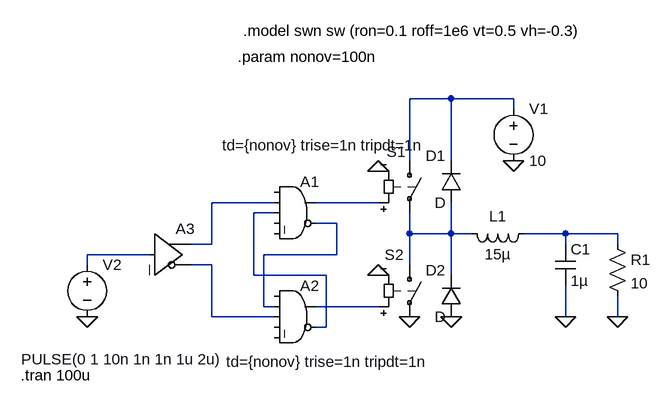
[diagram p0: schematic nonov.asc]
nonov.asc, the LTspice schematic file:
Version 4
SHEET 1 880 680
WIRE 352 16 288 16
WIRE 448 16 352 16
WIRE 448 32 448 16
WIRE 288 112 288 16
WIRE 352 112 352 16
WIRE 80 176 -16 176
WIRE 240 176 144 176
WIRE 80 192 48 192
WIRE 176 208 144 208
WIRE 288 224 288 192
WIRE 352 224 352 176
WIRE 352 224 288 224
WIRE 384 224 352 224
WIRE 528 224 464 224
WIRE 608 224 528 224
WIRE -16 240 -16 176
WIRE -16 240 -48 240
WIRE 528 240 528 224
WIRE 608 240 608 224
WIRE -112 256 -208 256
WIRE 176 256 176 208
WIRE 176 256 64 256
WIRE -208 272 -208 256
WIRE -16 272 -48 272
WIRE 288 272 288 224
WIRE 48 288 48 192
WIRE 160 288 48 288
WIRE 352 288 352 224
WIRE 64 336 64 256
WIRE 80 336 64 336
WIRE 240 336 144 336
WIRE -16 352 -16 272
WIRE 80 352 -16 352
WIRE 528 352 528 304
WIRE 608 352 608 320
WIRE 160 368 160 288
WIRE 160 368 144 368
FLAG 240 128 0
FLAG 240 288 0
FLAG 528 352 0
FLAG 608 352 0
FLAG 288 352 0
FLAG 448 112 0
FLAG -208 352 0
FLAG 352 352 0
SYMBOL sw 288 96 R0
WINDOW 0 -35 2 Left 0
SYMATTR InstName S1
SYMATTR Value ""
SYMATTR SpiceModel swn
SYMBOL sw 288 256 R0
WINDOW 0 -38 0 Left 0
SYMATTR InstName S2
SYMATTR Value ""
SYMATTR SpiceModel swn
SYMBOL ind 480 208 R90
WINDOW 0 5 56 VBottom 0
WINDOW 3 32 56 VTop 0
SYMATTR InstName L1
SYMATTR Value 15µ
SYMBOL cap 512 240 R0
SYMATTR InstName C1
SYMATTR Value 1µ
SYMBOL res 592 224 R0
SYMATTR InstName R1
SYMATTR Value 10
SYMBOL voltage 448 16 R0
WINDOW 123 0 0 Left 0
WINDOW 39 0 0 Left 0
SYMATTR InstName V1
SYMATTR Value 10
SYMBOL Digital\\and 112 128 R0
WINDOW 3 -112 -40 Left 0
SYMATTR InstName A1
SYMATTR Value td={nonov} trise=1n tripdt=1n
SYMBOL Digital\\buf -112 192 R0
SYMATTR InstName A3
SYMBOL voltage -208 256 R0
WINDOW 3 -101 161 Left 0
WINDOW 123 0 0 Left 0
WINDOW 39 0 0 Left 0
SYMATTR InstName V2
SYMATTR Value PULSE(0 1 10n 1n 1n 1u 2u)
SYMBOL Digital\\and 112 288 R0
WINDOW 3 -106 133 Left 0
SYMATTR InstName A2
SYMATTR Value td={nonov} trise=1n tripdt=1n
SYMBOL diode 368 176 R180
WINDOW 0 24 72 Left 0
WINDOW 3 24 0 Left 0
SYMATTR InstName D1
SYMBOL diode 368 352 R180
WINDOW 0 24 72 Left 0
WINDOW 3 24 0 Left 0
SYMATTR InstName D2
TEXT 32 -88 Left 0 !.model swn sw (ron=0.1 roff=1e6 vt=0.5 vh=-0.3)
TEXT -310 442 Left 0 !.tran 100u
TEXT 24 -48 Left 0 !.param nonov=100n

The netlist it stands for:
* nonov.asc
S1 N001 N006 N003 0 swn
S2 N006 0 N010 0 swn
L1 N007 N006 15µ
C1 N007 0 1µ
R1 N007 0 10
V1 N001 0 10
A1 0 N002 N004 0 0 N005 N003 0 AND td={nonov} trise=1n tripdt=1n
A3 N008 0 0 0 0 N009 N002 0 BUF
V2 N008 0 PULSE(0 1 10n 1n 1n 1u 2u)
A2 0 N005 N009 0 0 N004 N010 0 AND td={nonov} trise=1n tripdt=1n
D1 N006 N001 D
D2 0 N006 D
.model D D
.lib standard.dio
.model swn sw (ron=0.1 roff=1e6 vt=0.5 vh=-0.3)
.tran 100u
.param nonov=100n
.backanno
.end